# EAGLE board BMC2267ltcvV1.0Proto (EAGLE 5.11)
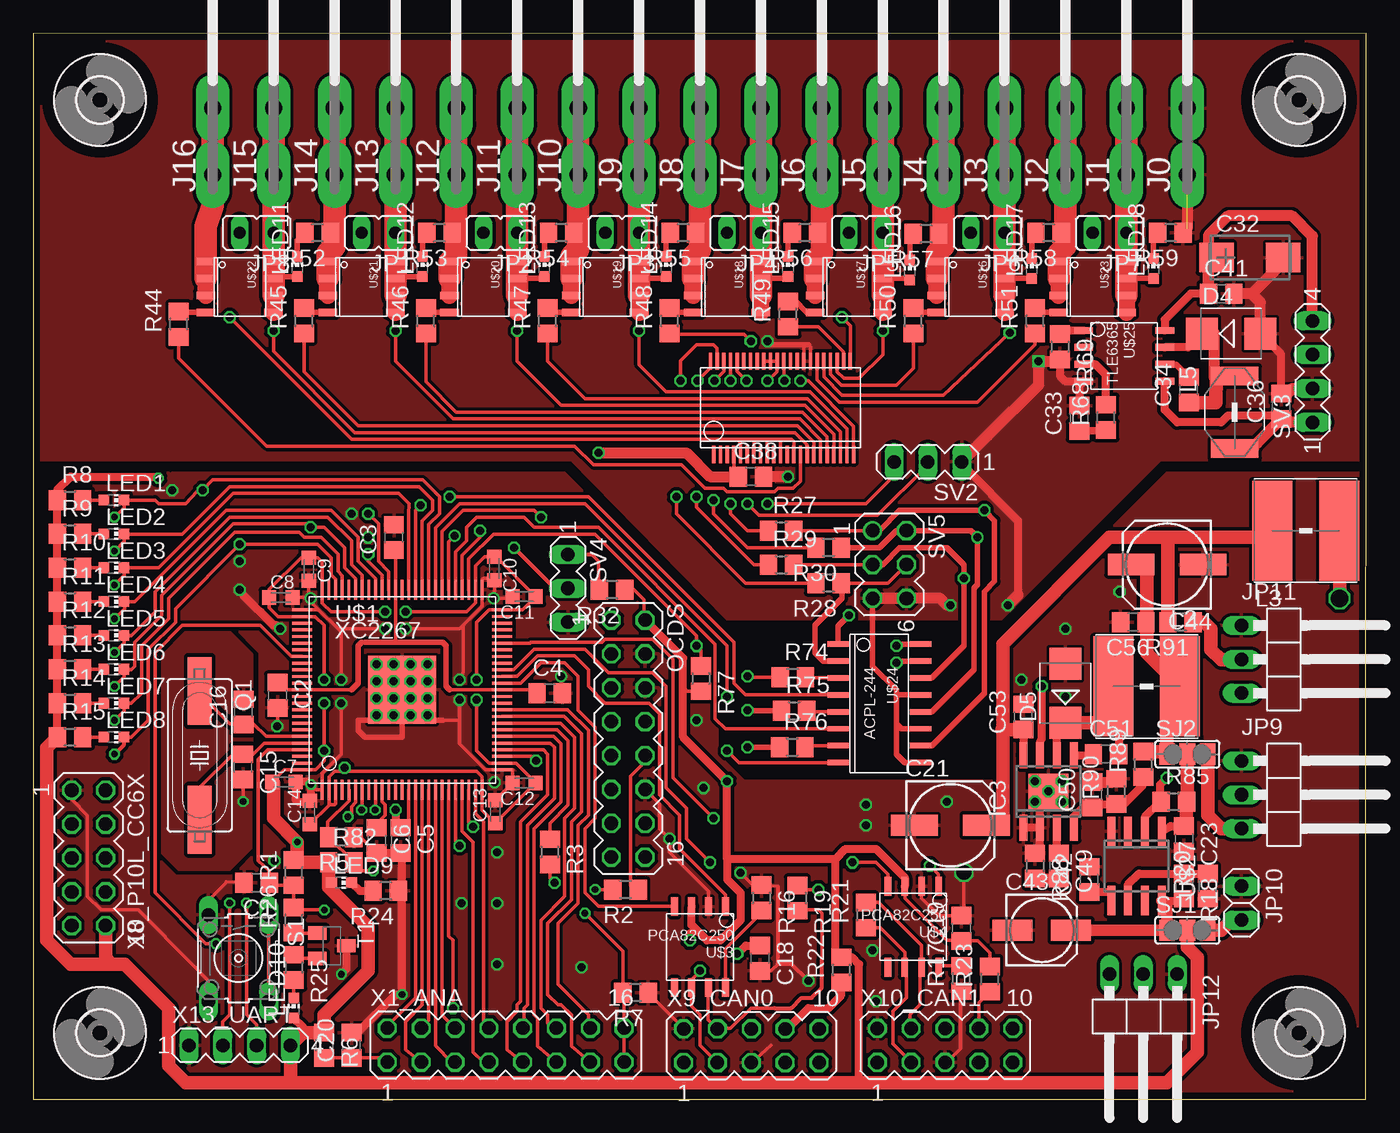
[diagram p2: board, top side]
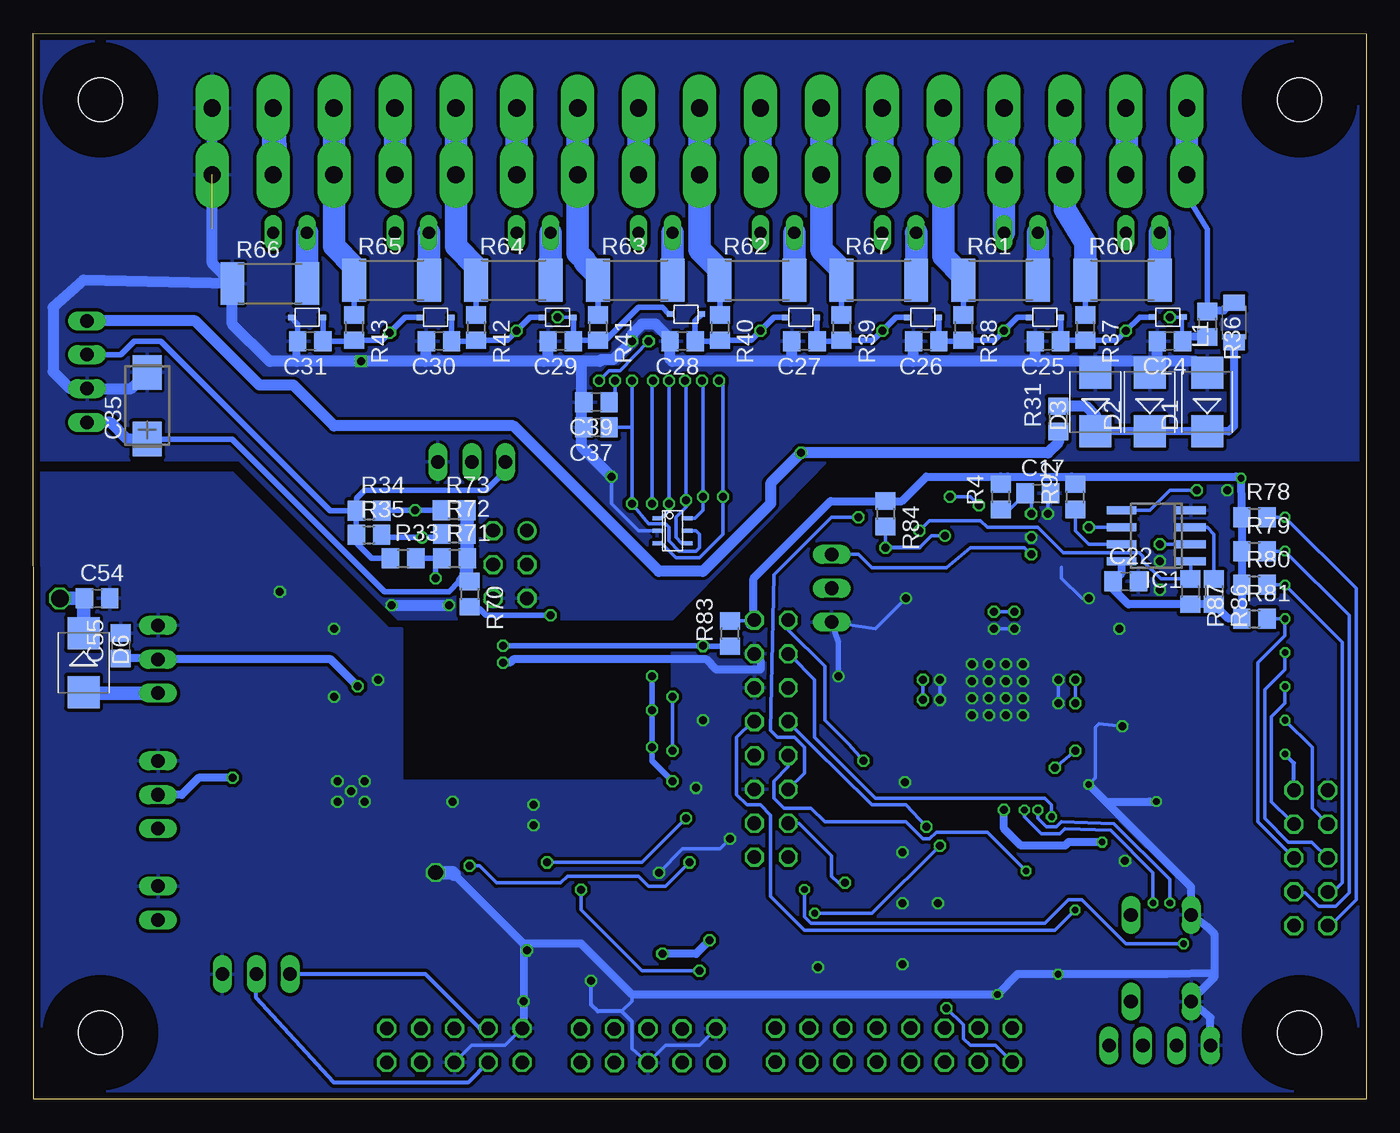
[diagram p3: board, bottom side, seen from below]

Size 100.04 x 79.99 mm. Coordinates in mm from the lower left corner, seen from the top.
Outline: 0,0 99.99,0 100.04,79.99 0,79.96 0,0
Copper layers (1*16): Top 0.035mm / dielectric 1.5mm / Bottom 0.035mm
Design rules "leiton *": minimum track width 6mil, minimum drill 0.3mm, track to track 6mil, track to pad 6mil, pad to pad 6mil, via to via 6mil, smd to smd 6mil, copper to edge 20mil, drill to drill 8mil, minimum pad ring 8mil, minimum via ring 6mil, stop-mask expansion 3mil, vias tented up to drill 0mil, thermal gap 8mil

## Footprints (pad centres in the part's own frame; a part is rotated, then mirrored left to right if it is on the bottom)
C0805 = smd 1.3 x 1.5: 1 -0.95,0; 2 0.95,0
C0603K = smd 1.05 x 1.08: 1 -0.875,0; 2 0.875,0
153CLV-0605 = smd 3.5 x 1.6: + 2.7,0; - -2.7,0
CT6032 = smd 2.6 x 2.2: + -2.5,0; - 2.5,0
153CLV-0505 = smd 3 x 1.6: + 2.2,0; - -2.2,0
SMB = smd 2.4 x 2.4: A 2.2,0; C -2.2,0
3,3 = hole 3.3: 0,0
SO-08 = smd 0.6 x 2.2: 1 -1.905,-2.6; 2 -0.635,-2.6; 3 0.635,-2.6; 4 1.905,-2.6; 5 1.905,2.6; 6 0.635,2.6; 7 -0.635,2.6; 8 -1.905,2.6
SO8-EXP = smd 0.6 x 1.946: 1 -1.905,-2.727; 2 -0.635,-2.727; 3 0.635,-2.727; 4 1.905,-2.727; 5 1.905,2.727; 6 0.635,2.727; 7 -0.635,2.727; 8 -1.905,2.727 | smd 3 x 2.65: 9 0,0
F061.200 = drill 1.3 pad 2.5 long: 1A -2.5,0; 1B 2.5,0
JP1 = drill 0.914 long: 1 0,-1.27; 2 0,1.27
1X03/90 = drill 1.016 long: 1 -2.54,-3.81; 2 0,-3.81; 3 2.54,-3.81
1X02 = drill 1.016 long: 1 -1.27,0; 2 1.27,0
L3216C = smd 1.2 x 1.6: 1 -1.5,0; 2 1.5,0
WE-PD2_L = smd 3 x 7.5: 1 -2.5,0; 2 2.5,0
S = smd 1.4 x 3.56: 1 -2.73,0; 2 2.73,0
CHIP-LED0603 = smd 0.8 x 0.8: A 0,-0.75; C 0,0.75
MA08-2 = drill 1.016 octagon: 1 -8.89,-1.27; 2 -8.89,1.27; 3 -6.35,-1.27; 4 -6.35,1.27; 5 -3.81,-1.27; 6 -3.81,1.27; 7 -1.27,-1.27; 8 -1.27,1.27; 9 1.27,-1.27; 10 1.27,1.27; 11 3.81,-1.27; 12 3.81,1.27; 13 6.35,-1.27; 14 6.35,1.27; 15 8.89,-1.27; 16 8.89,1.27
SM49 = smd 5.08 x 1.778: 1 -4.826,0; 2 4.826,0
R0805 = smd 1.3 x 1.5: 1 -0.95,0; 2 0.95,0
R2512 = smd 1.8 x 3.2: 1 -2.8,0; 2 2.8,0
B3F-10XX = drill 1.016 long: 1 -3.251,2.261; 2 3.251,2.261; 3 -3.251,-2.261; 4 3.251,-2.261
SJ_2 = smd 1.168 x 1.6: 1 -1.524,0; 2 0,0; 3 1.524,0
MA03-1 = drill 1.016 long: 1 -2.54,0; 2 0,0; 3 2.54,0
MA04-1 = drill 1.016 long: 1 -3.81,0; 2 -1.27,0; 3 1.27,0; 4 3.81,0
MA03-2 = drill 1.016 round: 1 -2.54,-1.27 | drill 1.016 octagon: 2 -2.54,1.27; 3 0,-1.27; 4 0,1.27; 5 2.54,-1.27; 6 2.54,1.27
SOT23-BEC = smd 1 x 1.4: B -0.95,-1.1; C 0,1.1; E 0.95,-1.1
LQFP100 = smd 0.22 x 1.5: 1 -6,-7.5; 2 -5.5,-7.5; 3 -5,-7.5; 4 -4.5,-7.5; 5 -4,-7.5; 6 -3.5,-7.5; 7 -3,-7.5; 8 -2.5,-7.5; 9 -2,-7.5; 10 -1.5,-7.5; 11 -1,-7.5; 12 -0.5,-7.5; 13 0,-7.5; 14 0.5,-7.5; 15 1,-7.5; 16 1.5,-7.5; 17 2,-7.5; 18 2.5,-7.5; 19 3,-7.5; 20 3.5,-7.5; 21 4,-7.5; 22 4.5,-7.5; 23 5,-7.5; 24 5.5,-7.5; 25 6,-7.5; 51 6,7.5; 52 5.5,7.5; 53 5,7.5; 54 4.5,7.5; 55 4,7.5; 56 3.5,7.5; 57 3,7.5; 58 2.5,7.5; 59 2,7.5; 60 1.5,7.5; 61 1,7.5; 62 0.5,7.5; 63 0,7.5; 64 -0.5,7.5; 65 -1,7.5; 66 -1.5,7.5; 67 -2,7.5; 68 -2.5,7.5; 69 -3,7.5; 70 -3.5,7.5; 71 -4,7.5; 72 -4.5,7.5; 73 -5,7.5; 74 -5.5,7.5; 75 -6,7.5 | smd 1.5 x 0.22: 26 7.5,-6; 27 7.5,-5.5; 28 7.5,-5; 29 7.5,-4.5; 30 7.5,-4; 31 7.5,-3.5; 32 7.5,-3; 33 7.5,-2.5; 34 7.5,-2; 35 7.5,-1.5; 36 7.5,-1; 37 7.5,-0.5; 38 7.5,0; 39 7.5,0.5; 40 7.5,1; 41 7.5,1.5; 42 7.5,2; 43 7.5,2.5; 44 7.5,3; 45 7.5,3.5; 46 7.5,4; 47 7.5,4.5; 48 7.5,5; 49 7.5,5.5; 50 7.5,6; 76 -7.5,6; 77 -7.5,5.5; 78 -7.5,5; 79 -7.5,4.5; 80 -7.5,4; 81 -7.5,3.5; 82 -7.5,3; 83 -7.5,2.5; 84 -7.5,2; 85 -7.5,1.5; 86 -7.5,1; 87 -7.5,0.5; 88 -7.5,0; 89 -7.5,-0.5; 90 -7.5,-1; 91 -7.5,-1.5; 92 -7.5,-2; 93 -7.5,-2.5; 94 -7.5,-3; 95 -7.5,-3.5; 96 -7.5,-4; 97 -7.5,-4.5; 98 -7.5,-5; 99 -7.5,-5.5; 100 -7.5,-6 | smd 5.08 x 5.08: EXPAD 0,0
PDSO8 = smd 0.508 x 1.4: 1 -1.905,-3.04; 2 -0.635,-3.04; 3 0.635,-3.04; 4 1.905,-3.04; 5 1.905,3.04; 6 0.635,3.04; 7 -0.635,3.04; 8 -1.905,3.04
SSOP44 = smd 0.25 x 1.3: 1 -5.25,-3.5; 2 -4.75,-3.5; 3 -4.25,-3.5; 4 -3.75,-3.5; 5 -3.25,-3.5; 6 -2.75,-3.5; 7 -2.25,-3.5; 8 -1.75,-3.5; 9 -1.25,-3.5; 10 -0.75,-3.5; 11 -0.25,-3.5; 12 0.25,-3.5; 13 0.75,-3.5; 14 1.25,-3.5; 15 1.75,-3.5; 16 2.25,-3.5; 17 2.75,-3.5; 18 3.25,-3.5; 19 3.75,-3.5; 20 4.25,-3.5; 21 4.75,-3.5; 22 5.25,-3.5; 23 5,3.5; 24 4.5,3.5; 25 4,3.5; 26 3.5,3.5; 27 3,3.5; 28 2.5,3.5; 29 2,3.5; 30 1.5,3.5; 31 1,3.5; 32 0.5,3.5; 33 0,3.5; 34 -0.5,3.5; 35 -1,3.5; 36 -1.5,3.5; 37 -2,3.5; 38 -2.5,3.5; 39 -3,3.5; 40 -3.5,3.5; 41 -4,3.5; 42 -4.5,3.5; 43 -5,3.5; 44 -5.5,3.5
SOT457 = smd 0.3 x 0.7: 1 -0.95,-1.15; 2 0,-1.15; 3 0.95,-1.15; 4 0.95,1.15; 5 0,1.15; 6 -0.95,1.15
SOD323 = smd 0.45 x 0.4: A -1.2,0; K 1.2,0
SO8 = smd 0.559 x 1.397: 1 -1.905,-2.54; 2 -0.635,-2.54; 3 0.635,-2.54; 4 1.905,-2.54; 5 1.905,2.54; 6 0.635,2.54; 7 -0.635,2.54; 8 -1.905,2.54
SO16 = smd 0.406 x 1.6: 1 -4.445,-3.09; 2 -3.175,-3.09; 3 -1.905,-3.09; 4 -0.635,-3.09; 5 0.635,-3.09; 6 1.905,-3.09; 7 3.175,-3.09; 8 4.445,-3.09; 9 4.445,3.09; 10 3.175,3.09; 11 1.905,3.09; 12 0.635,3.09; 13 -0.635,3.09; 14 -1.905,3.09; 15 -3.175,3.09; 16 -4.445,3.09
SO8' = smd 0.6 x 2.2: 1 -1.905,-2.6; 2 -0.635,-2.6; 3 0.635,-2.6; 4 1.905,-2.6; 5 1.905,2.6; 6 0.635,2.6; 7 -0.635,2.6; 8 -1.905,2.6
MA05-2 = drill 1.016 octagon: 1 -5.08,-1.27; 2 -5.08,1.27; 3 -2.54,-1.27; 4 -2.54,1.27; 5 0,-1.27; 6 0,1.27; 7 2.54,-1.27; 8 2.54,1.27; 9 5.08,-1.27; 10 5.08,1.27

## Placement (x,y rotation side)
C1  100n  [C0805]  16.76,16.26 180 top
C2  470n  [C0805]  18.34,30.32 270 top
C3  470n  [C0805]  27.06,42.16 90 top
C4  470n  [C0805]  38.76,30.47 0 top
C5  100n  [C0805]  27.56,19.43 270 top
C6  1u  [C0805]  25.78,19.43 270 top
C7  100n  [C0603K]  18.8,23.83 0 top
C8  100n  [C0603K]  18.58,37.67 0 top
C9  100n  [C0603K]  20.68,39.78 270 top
C10  100n  [C0603K]  34.61,39.84 270 top
C11  100n  [C0603K]  36.83,37.73 180 top
C12  100n  [C0603K]  36.83,23.75 180 top
C13  100n  [C0603K]  34.67,21.59 90 top
C14  100n  [C0603K]  20.75,21.53 90 top
C15  18p  [C0805]  15.75,24.94 270 top
C16  18p  [C0805]  15.78,29.08 90 top
C17  10n_opt  [C0805]  24.64,45.47 0 bottom
C18  100n  [C0805]  54.54,10.6 270 top
C19  100n  [C0805]  69.66,12.84 90 top
C20  1u  [C0805]  23.88,4.06 90 top
C21  47u36v  [153CLV-0605]  68.83,20.57 0 top
C22  100n  [C0805]  18.03,38.86 0 bottom
C23  470n  [C0805]  86.36,19.56 270 top
C24  100n  [C0805]  14.73,56.9 180 bottom
C25  100n  [C0805]  23.88,56.9 180 bottom
C26  100n  [C0805]  33.02,56.9 180 bottom
C27  100n  [C0805]  42.16,56.9 180 bottom
C28  100n  [C0805]  51.31,56.9 180 bottom
C29  100n  [C0805]  60.45,56.9 180 bottom
C30  100n  [C0805]  69.6,56.9 180 bottom
C31  100n  [C0805]  79.25,56.9 180 bottom
C32  22u  [CT6032]  91.3,63.16 0 top
C33  470n  [C0805]  78.49,51.11 90 top
C34  10n  [C0805]  86.72,53.24 90 top
C35  100u  [CT6032]  91.49,52.04 90 bottom
C36  220n  [C0805]  93.66,52.01 90 top
C37  1u  [C0805]  57.78,50.42 180 bottom
C38  100n  [C0805]  53.85,46.74 0 top
C39  1u  [C0805]  57.78,52.32 180 bottom
C41  220n  [C0805]  89.15,60.45 0 top
C42  100n  [C0805]  79.25,16.51 90 top
C43  22u10v  [153CLV-0505]  75.69,12.7 0 top
C44  100u10v  [153CLV-0605]  85.09,40.13 180 top
C49  22n  [C0805]  76.96,17.53 270 top
C50  470p  [C0805]  79.5,22.86 90 top
C51  220n  [C0805]  80.52,25.91 0 top
C53  100n  [C0805]  74.3,28.7 90 top
C54  100n  [C0805]  95.25,37.59 0 bottom
C55  100n  [C0805]  93.47,34.04 90 bottom
C56  220n  [C0805]  82.55,35.81 180 top
D1  MBRS130LT3  [SMB]  11.94,52.32 90 bottom
D2  MBRS130LT3  [SMB]  16.26,52.32 90 bottom
D3  MBRS130LT3  [SMB]  20.32,52.32 90 bottom
D4  [SMB]  89.9,57.46 0 top
D5  [SMB]  77.47,30.48 90 top
D6  MBRS130LT3  [SMB]  96.27,32.77 270 bottom
H1  MOUNT-HOLE3.3  [3,3]  5,5 0 top
H2  MOUNT-HOLE3.3  [3,3]  95,5 0 top
H3  MOUNT-HOLE3.3  [3,3]  5,75 0 top
H4  MOUNT-HOLE3.3  [3,3]  95,75 0 top
IC1  25C320  [SO-08]  15.75,42.29 90 bottom
IC3  TLE8366  [SO8-EXP]  76.2,23.11 0 top
J0  PIN2F061.200  [F061.200]  86.61,71.88 90 top
J1  PIN2F061.200  [F061.200]  82.04,71.88 90 top
J2  PIN2F061.200  [F061.200]  77.47,71.88 90 top
J3  PIN2F061.200  [F061.200]  72.9,71.88 90 top
J4  PIN2F061.200  [F061.200]  68.33,71.88 90 top
J5  PIN2F061.200  [F061.200]  63.75,71.88 90 top
J6  PIN2F061.200  [F061.200]  59.18,71.88 90 top
J7  PIN2F061.200  [F061.200]  54.61,71.88 90 top
J8  PIN2F061.200  [F061.200]  50.04,71.88 90 top
J9  PIN2F061.200  [F061.200]  45.47,71.88 90 top
J10  PIN2F061.200  [F061.200]  40.89,71.88 90 top
J11  PIN2F061.200  [F061.200]  36.32,71.88 90 top
J12  PIN2F061.200  [F061.200]  31.75,71.88 90 top
J13  PIN2F061.200  [F061.200]  27.18,71.88 90 top
J14  PIN2F061.200  [F061.200]  22.61,71.88 90 top
J15  PIN2F061.200  [F061.200]  18.03,71.88 90 top
J16  PIN2F061.200  [F061.200]  13.46,71.88 90 top
JP1  [JP1]  25.91,65.02 90 top
JP2  [JP1]  35.05,65.02 90 top
JP3  [JP1]  44.2,65.02 90 top
JP4  [JP1]  53.34,65.02 90 top
JP5  [JP1]  62.48,65.02 90 top
JP6  [JP1]  71.63,65.02 90 top
JP7  [JP1]  80.77,65.02 90 top
JP8  [JP1]  16.76,65.02 90 top
JP9  [1X03/90]  94.49,22.86 270 top
JP10  [1X02]  90.68,14.73 270 top
JP11  [1X03/90]  94.49,33.02 270 top
JP12  [1X03/90]  83.31,5.59 180 top
L1  [L3216C]  9.91,58.29 90 bottom
L2  47µH  [WE-PD2_L]  83.57,30.99 180 top
L3  47µH  [WE-PD2_L]  95.5,42.67 0 top
L5  220µ  [S]  90.17,51.56 270 top
LED1  ge  [CHIP-LED0603]  6.06,44.97 270 top
LED2  ge  [CHIP-LED0603]  6.06,42.43 270 top
LED3  ge  [CHIP-LED0603]  6.06,39.89 270 top
LED4  ge  [CHIP-LED0603]  6.06,37.35 270 top
LED5  ge  [CHIP-LED0603]  6.06,34.81 270 top
LED6  ge  [CHIP-LED0603]  6.06,32.27 270 top
LED7  ge  [CHIP-LED0603]  6.06,29.73 270 top
LED8  ge  [CHIP-LED0603]  6.06,27.19 270 top
LED9  gr  [CHIP-LED0603]  23.15,16.27 270 top
LED10  rt  [CHIP-LED0603]  19.56,6.86 0 top
LED11  ge  [CHIP-LED0603]  19.81,62.48 0 top
LED12  ge  [CHIP-LED0603]  29.21,62.48 0 top
LED13  ge  [CHIP-LED0603]  38.35,62.48 0 top
LED14  ge  [CHIP-LED0603]  47.5,62.48 0 top
LED15  ge  [CHIP-LED0603]  56.64,62.48 0 top
LED16  ge  [CHIP-LED0603]  65.79,62.23 0 top
LED17  ge  [CHIP-LED0603]  74.93,62.36 0 top
LED18  ge  [CHIP-LED0603]  84.07,62.36 0 top
OCDS  [MA08-2]  44.65,27.07 270 top
Q1  8 MHz  [SM49]  12.48,25.81 270 top
R1  10k  [R0805]  19.56,17.02 90 top
R2  0R_opt  [R0805]  44.45,15.75 180 top
R3  0R_opt  [R0805]  38.77,18.57 270 top
R4  10k  [R0805]  27.43,45.21 90 bottom
R5  10k  [R0805]  23.11,19.68 180 top
R6  0R  [R0805]  21.84,4.06 270 top
R7  0R  [R0805]  45.2,8 180 top
R8  1k5  [R0805]  2.76,44.97 0 top
R9  1k5  [R0805]  2.76,42.43 0 top
R10  1k5  [R0805]  2.76,39.89 0 top
R11  1k5  [R0805]  2.76,37.35 0 top
R12  1k5  [R0805]  2.76,34.81 0 top
R13  1k5  [R0805]  2.76,32.27 0 top
R14  1k5  [R0805]  2.76,29.73 0 top
R15  1k5  [R0805]  2.76,27.19 0 top
R16  0R  [R0805]  54.65,15.13 270 top
R17  0R  [R0805]  69.66,9.06 90 top
R18  100k  [R0805]  86.36,16 270 top
R19  120R  [R0805]  57.35,15.11 270 top
R20  56k  [R0805]  88.14,16 90 top
R21  120R  [R0805]  62.48,13.83 90 top
R22  0R_opt  [R0805]  60.66,9.71 90 top
R23  0R_opt  [R0805]  71.79,9.03 90 top
R24  1k5  [R0805]  26.45,15.65 180 top
R25  1k5  [R0805]  19.56,9.91 270 top
R26  47k  [R0805]  19.56,13.46 90 top
R27  100R  [R0805]  56.13,42.67 0 top
R28  100R  [R0805]  59.69,38.73 180 top
R29  100R  [R0805]  56.13,40.13 0 top
R30  20R  [R0805]  59.69,41.4 180 top
R31  100R  [R0805]  23.11,51.05 90 bottom
R32  4k7  [R0805]  43.43,38.23 180 top
R33  1M  [R0805]  72.28,40.6 0 bottom
R34  1M  [R0805]  74.84,44.18 0 bottom
R35  1M  [R0805]  74.85,42.37 0 bottom
R36  100R  [R0805]  11.94,58.17 270 bottom
R37  100R  [R0805]  21.08,57.91 270 bottom
R38  100R  [R0805]  30.23,57.91 270 bottom
R39  100R  [R0805]  39.37,57.91 270 bottom
R40  100R  [R0805]  48.51,57.91 270 bottom
R41  100R  [R0805]  57.66,57.91 270 bottom
R42  100R  [R0805]  66.8,57.91 270 bottom
R43  100R  [R0805]  75.95,57.91 270 bottom
R44  3k3  [R0805]  10.92,58.17 90 top
R45  3k3  [R0805]  20.32,58.42 90 top
R46  3k3  [R0805]  29.46,58.42 90 top
R47  3k3  [R0805]  38.61,58.42 90 top
R48  3k3  [R0805]  47.75,58.42 90 top
R49  3k3  [R0805]  56.64,58.93 90 top
R50  3k3  [R0805]  66.04,58.42 90 top
R51  3k3  [R0805]  75.18,58.42 90 top
R52  470R  [R0805]  21.34,65.02 180 top
R53  470R  [R0805]  30.48,65.02 180 top
R54  470R  [R0805]  39.62,65.02 180 top
R55  470R  [R0805]  48.77,65.02 180 top
R56  470R  [R0805]  57.91,65.02 180 top
R57  470R  [R0805]  67,64.94 180 top
R58  470R  [R0805]  76.2,65.02 180 top
R59  470R  [R0805]  85.34,65.02 180 top
R60  10R  [R2512]  18.29,61.47 0 bottom
R61  10R  [R2512]  27.43,61.47 0 bottom
R62  10R  [R2512]  45.72,61.47 0 bottom
R63  10R  [R2512]  54.86,61.47 0 bottom
R64  10R  [R2512]  64.01,61.47 0 bottom
R65  10R  [R2512]  73.15,61.47 0 bottom
R66  10R  [R2512]  82.3,61.21 0 bottom
R67  10R  [R2512]  36.58,61.47 0 bottom
R68  47k  [R0805]  80.52,51.17 90 top
R69  100k  [R0805]  77.05,56.47 270 top
R70  470R  [R0805]  67.28,37.92 270 bottom
R71  470R  [R0805]  68.42,40.6 0 bottom
R72  470R  [R0805]  68.44,42.42 0 bottom
R73  470R  [R0805]  68.46,44.19 0 bottom
R74  470R  [R0805]  57,31.67 0 top
R75  470R  [R0805]  57.11,29.18 0 top
R76  470R  [R0805]  56.96,26.43 0 top
R77  470R  [R0805]  50.1,31.58 270 top
R78  220R_opt  [R0805]  8.38,43.69 0 bottom
R79  220R_opt  [R0805]  8.38,41.15 0 bottom
R80  220R_opt  [R0805]  8.38,38.61 0 bottom
R81  220R_opt  [R0805]  8.38,36.07 0 bottom
R82  1k_opt  [R0805]  23.11,17.78 0 top
R83  1k_opt  [R0805]  47.74,34.95 90 bottom
R84  4k7  [R0805]  36.07,43.94 270 bottom
R85  OPT_0R  [R0805]  85.6,22.35 0 top
R86  10k  [R0805]  11.43,38.1 270 bottom
R87  10k  [R0805]  13.21,38.1 270 bottom
R88  22k  [R0805]  75.18,17.53 270 top
R89  47k  [R0805]  83.31,25.15 90 top
R90  47k  [R0805]  81.28,23.11 90 top
R91  OPT_0R  [R0805]  86.11,35.81 180 top
R92  10k  [R0805]  21.84,45.21 90 bottom
S1  [B3F-10XX]  15.4,10.6 270 top
SJ1  [SJ_2]  86.61,12.7 0 top
SJ2  [SJ_2]  86.61,25.91 0 top
SV2  [MA03-1]  67.14,47.83 180 top
SV3  [MA04-1]  96.01,54.61 90 top
SV4  [MA03-1]  40.13,38.35 270 top
SV5  [MA03-2]  64.26,40.13 270 top
T1  [SOT23-BEC]  22.41,11.53 270 top
U$1  XC2267  [LQFP100]  27.69,30.73 0 top
U$3  PCA82C250  [PDSO8]  50.04,11.43 180 top
U$4  PCA82C250  [PDSO8]  66.04,12.95 180 top
U$5  LTC6802-1  [SSOP44]  56.32,51.89 0 top
U$6  PRTR5V0U4D  [SOT457]  52.07,42.67 270 bottom
U$8  PDZ7.5B  [SOD323]  14.89,58.7 0 bottom
U$9  PDZ7.5B  [SOD323]  24.13,58.67 0 bottom
U$10  PDZ7.5B  [SOD323]  33.27,58.67 0 bottom
U$11  PDZ7.5B  [SOD323]  42.42,58.67 0 bottom
U$12  PDZ7.5B  [SOD323]  51.05,58.93 0 bottom
U$13  PDZ7.5B  [SOD323]  60.71,58.67 0 bottom
U$14  PDZ7.5B  [SOD323]  69.85,58.67 0 bottom
U$15  PDZ7.5B  [SOD323]  79.5,58.67 0 bottom
U$16  SI4435BDY  [SO8]  70.36,60.96 270 top
U$17  SI4435BDY  [SO8]  61.21,60.96 270 top
U$18  SI4435BDY  [SO8]  52.07,60.96 270 top
U$19  SI4435BDY  [SO8]  42.93,60.96 270 top
U$20  SI4435BDY  [SO8]  33.78,60.96 270 top
U$21  SI4435BDY  [SO8]  24.64,60.96 270 top
U$22  SI4435BDY  [SO8]  15.49,60.96 270 top
U$23  SI4435BDY  [SO8]  79.5,60.96 270 top
U$24  ACPL-244  [SO16]  63.5,29.72 270 top
U$25  TLE6365  [PDSO8]  81.88,55.79 270 top
U$27  TLE4263GS  [SO8']  82.8,17.53 180 top
X1_ANA  [MA08-2]  35.46,4.08 0 top
X8_P10L_CC6X  [MA05-2]  4.15,18.12 270 top
X9_CAN0  [MA05-2]  53.89,4.03 0 top
X10_CAN1  [MA05-2]  68.43,4.06 0 top
X13_UART  [MA04-1]  15.49,4.06 0 top

## Tracks (layer width: path | path; a pad name or v marks a point on that pad's centre or on a via)
5VA
  Top 0.61: U$25.5 84.92,51.73 85.85,50.8 89.15,50.8 89.66,51.31 93.41,51.31 C36.1 | L5.2 91.69,48.83 91.69,49.02 91.62,49.02 | 91.62,49.02 89.92,49.02 | 93.31,50.71 91.62,49.02
  Top 0.813: 91.83,49.23 93.31,50.71 C36.1 93.91,50.8 SV3.1
  Bottom 0.406: R73.2 67.74,44.17 | R72.2 67.72,42.41 | R71.2 67.53,40.41 | R70.1 67.54,38.86 67.82,38.86 68.07,38.86 68.83,38.1 73.66,38.1 85.1,49.54 C35.+
  Bottom 0.813: C35.+ 92.98,49.54 94.23,50.8 SV3.1
  Bottom 1.016: 67.53,40.41 67.53,39.15 67.82,38.86 | R73.2 67.49,44.17 R72.2 67.47,42.41 R71.2
+5V  (via drill 0.5, 0.6)
  Top 0.254: OCDS.2 45.97,36.02 | v33.27,31.5 33.27,35.81 34.19,36.73 U$1.50 36.73,36.73 37.59,37.59 37.59,37.62 C11.1 34.72,40.72 C10.1 33.86,40.72 33.19,40.04 U$1.52 33.19,37.25 32.51,36.58 v27.94,36.58 | v33.27,29.97 33.27,26.16 34.2,25.23 U$1.27 36.22,25.23 C12.1 C13.1 | v26.42,36.58 22.35,36.58 21.69,37.24 U$1.75 21.69,40.29 21.34,40.64 20.7,40.64 C9.1 20.09,40.66 17.7,38.27 C8.1 17.7,36.91 18.38,36.23 U$1.77 21.17,36.23 21.84,35.56 v21.84,31.5 | U$1.2 22.19,23.71 | 23.11,24.64 22.61,24.64 22.19,24.22 U$1.2 | v23.37,24.89 23.11,24.64 | U$1.3 22.69,22.18 22.61,22.1 22.35,22.1 22.19,22.26 | U$1.2 22.19,22.26 | 27.94,20.47 C5.1 28.19,20.88 U$1.14 | 23.11,24.64 33.27,24.64 33.69,24.23 U$1.25 33.69,21.69 34.54,20.83 | v21.84,29.72 v21.84,26.16 21.84,25.4 21.18,24.73 U$1.100 18.83,24.73 C7.1 | R11.1 2.27,37.35 2.03,37.59 2.03,37.34 | C14.1 22.19,22.09 22.19,22.26 | R23.2 71.79,11.02 70.91,11.89 C19.1 69.62,11.94 68.58,11.94 65.41,15.11 U$4.3 | R74.1 53.93,31.67 53.85,31.75 v53.59,31.75 | R77.2 48.88,30.63 48.77,30.73 | 45.82,35.96 45.82,37.49 44.96,38.35 44.51,38.35 R32.1
  Top 0.406: R75.1 53.81,29.18 v53.59,29.21 | R76.1 53.86,26.43 v53.59,26.42
  Top 0.61: 49.66,12.83 50.55,11.94 51.56,11.94 53.09,13.46 53.09,15.49 52.07,16.51 52.07,18.03 | 49.66,12.83 49.38,13.1 49.4,13.12 U$3.3 | v49.28,11.94 49.28,12.45 49.66,12.83 | C18.1 53.46,11.55 v52.83,10.92 | X8_P10L_CC6X.10 5.51,12.95 | v27.18,21.72 27.18,20.64 C5.1 | 18.03,23.72 C7.1 | R1.2 19.81,17.97 | LED10.A 20.25,5.41 20.25,5.01 | R15.1 R14.1 R13.1 R12.1 R11.1 R10.1 R9.1 R8.1 1.81,45.75 2.79,46.74 9.4,46.74 | 52.07,18.03 v52.07,23.88 48.77,27.18 48.77,30.73 48.77,33.12 OCDS.2 45.82,35.96 | LED9.A 22.18,16.27 22.16,16.26 | U$4.3 65.41,16.64 63.25,18.8 60.96,18.8 60.2,18.03 | 61.98,1.27 61.98,10.16 61.47,10.67 R22.2 60.2,10.71 60.2,18.03 | 60.2,18.03 52.07,18.03
  Top 1.016: 18.03,23.72 18.03,21.08 v19.81,19.3 19.81,17.97 | R1.2 19.56,17.78 R82.1 22.16,16.26 22.16,15.94 25.15,12.95 25.15,9.65 21.84,6.35 R6.1 20.25,5.01 X13_UART.4 19.3,1.27 | SJ1.2 86.61,11.43 87.38,10.67 87.38,3.56 85.09,1.27 61.98,1.27 19.3,1.27 | 19.3,1.27 11.43,1.27 10.16,2.54 10.16,6.86 6.86,10.16 5.84,10.16 | 5.84,10.16 2.79,10.16 1.02,11.94 1.02,26.4 R15.1 | X8_P10L_CC6X.10 5.42,10.58 5.84,10.16
  Bottom 0.254: v33.27,31.5 v33.27,29.97 | v26.42,36.58 v27.94,36.58 | v21.84,26.16 v23.37,24.89 | v21.84,29.72 v21.84,31.5 | R83.2 45.98,35.9 OCDS.2 | 27.43,46.74 R4.2 | 27.43,46.74 | R92.2 21.84,46.48 22.1,46.74
  Bottom 0.406: v52.07,23.88 53.59,25.4 v53.59,26.42 v53.59,29.21 v53.59,31.75
  Bottom 0.61: v52.83,10.92 50.29,10.92 v49.28,11.94 | v27.18,21.72 27.18,20.32 25.91,19.05 22.61,19.05 22.35,19.3 v19.81,19.3 | 45.97,35.91 45.97,39.12 40.2,44.89 R84.1 34.86,44.89 33.02,46.74 27.43,46.74 26.92,46.74 | 45.97,35.91 46.28,35.61 | OCDS.2 45.97,35.91 | 26.92,46.74 22.1,46.74 9.78,46.74 v9.4,46.61 9.4,46.16 R78.1 R79.1 R80.1 R81.1 10.35,36.07 R86.2 R87.2 17.85,37.15 18.98,38.29 C22.1 18.35,39.5 IC1.8 | 26.92,46.74 26.86,46.67
/BRKIN  (via drill 0.6)
  Top 0.254: R3.2 38.77,16.6 v39.12,16.26
  Bottom 0.254: v39.12,16.26 39.62,16.26 40.13,16.76 40.13,18.29 42.57,20.72 OCDS.13
/BRKOUT
  Top 0.254: OCDS.10 45.92,25.35 44.83,24.26 44.83,16.06 R2.1
/CS_LTC  (via drill 0.6)
  Top 0.254: U$1.61 28.69,40.62 28.7,40.64 28.7,44.2 v29.08,44.58 | U$24.4 53.47,30.35 52.58,31.24 52.58,34.29 41.66,45.21 v31.24,45.21
  Bottom 0.254: v29.08,44.58 29.72,45.21 v31.24,45.21
/PORST  (via drill 0.5)
  Top 0.254: U$1.97 17.6,26.23 16.89,25.53 16.89,17.91 17.71,17.15 C1.1 | S1.2 S1.1 17.66,16.2 C1.1 | C1.1 17.9,16.07 R1.1 R26.2 19.75,14.22 v21.84,14.22
  Bottom 0.254: OCDS.8 46.08,28.34 47.24,27.18 47.24,22.86 46.48,22.1 45.47,22.1 44.7,21.34 44.7,15.24 42.16,12.7 23.37,12.7 v21.84,14.22
/TRST  (via drill 0.5)
  Top 0.254: U$1.5 23.69,22.42 22.1,20.83 22.1,19.75 R5.2 R82.2 24.7,17.14 v25.53,17.14
  Bottom 0.254: OCDS.9 43.38,24.95 44.45,23.88 44.45,22.61 43.69,21.84 41.66,21.84 40.64,20.83 34.54,20.83 33.27,19.56 32.77,19.56 32.26,20.07 28.45,20.07 v25.53,17.14
ADC0CH0
  Top 0.254: X1_ANA.7 33.95,2.79 33.78,2.79 33.02,3.56 33.02,19.3 32.19,20.14 U$1.22
ADC0CH3
  Top 0.254: U$1.24 33.19,21.42 33.78,20.83 33.78,5.75 X1_ANA.8 34.29,5.2
ADC0CH5
  Top 0.254: X1_ANA.9 35.56,3.72 35.56,5.84 36.32,6.6 36.32,7.11 36.58,7.37 36.58,20.83 38.61,22.86 38.61,25.91 38.28,26.23 U$1.29
ADC0CH8
  Top 0.254: X1_ANA.10 36.83,5.2 36.83,6.86 37.08,7.11 37.08,20.57 39.12,22.61 39.12,26.42 38.8,26.73 U$1.30
ADC0CH9
  Top 0.254: X1_ANA.11 37.85,3.98 37.85,6.1 37.59,6.35 37.59,20.32 39.62,22.35 39.62,26.67 39.06,27.23 U$1.31
ADC0CH11
  Top 0.254: 39.12,5.25 X1_ANA.12 38.61,5.75 38.61,6.35 38.1,6.86 38.1,13.46 39.88,15.24 39.88,21.08 40.64,21.84 40.64,27.18 39.58,28.23 U$1.33
ADC0CH13
  Top 0.254: X1_ANA.13 40.39,3.98 40.39,6.35 39.62,7.11 39.37,7.11 38.61,7.87 38.61,13.21 40.39,14.99 40.39,20.83 41.15,21.59 41.15,27.43 39.85,28.73 U$1.34
ADC0CH15
  Top 0.254: X1_ANA.14 41.66,5.25 41.66,6.35 39.37,8.64 39.37,13.21 40.89,14.73 40.89,20.57 41.66,21.34 41.66,27.69 40.11,29.23 U$1.35
ADC1CH0
  Top 0.254: X1_ANA.2 26.67,5.2 26.67,5.59 28.7,7.62 28.7,21.59 28.69,22.11 U$1.15
ADC1CH2
  Top 0.254: X1_ANA.3 27.94,3.72 27.94,5.84 29.19,7.09 U$1.16
ADC1CH4
  Top 0.254: U$1.17 29.69,5.93 X1_ANA.4
ADC1CH5
  Top 0.254: U$1.18 30.19,4.03 31.41,2.81 X1_ANA.5
ADC1CH6
  Top 0.254: 31.75,5.2 X1_ANA.6 30.69,6.31 U$1.19
C1  (via drill 0.6)
  Top 0.254: U$5.27 59.32,54.21 60.71,52.83 68.33,52.83 v73.28,57.53
  Bottom 0.406: U$14.A 72.14,58.67 v73.28,57.53 73.85,56.96 R43.2 76.01,56.9 C31.1 U$15.K
C2  (via drill 0.6)
  Top 0.254: U$5.25 60.32,54.61 60.83,54.1 61.98,54.1 63.75,55.88 v63.75,57.66
  Bottom 0.406: U$14.K C30.1 66.87,56.9 R42.2 64.45,56.96 v63.75,57.66 62.74,58.67 U$13.A
C3  (via drill 0.6)
  Top 0.254: U$5.23 61.32,58.06 v60.71,58.67
  Bottom 0.254: U$13.K v60.71,58.67
  Bottom 0.406: U$13.K C29.1 59.44,56.96 R41.2 57.59,56.9 57.15,56.9 54.61,59.44 52.83,59.44 52.32,58.93 U$12.A
C4  (via drill 0.6)
  Top 0.254: U$5.21 61.07,50.3 58.29,53.09 47.5,53.09 45.47,55.12 v45.47,57.66
  Bottom 0.406: U$11.A 44.45,58.67 v45.47,57.66 46.16,56.96 R40.2 | R40.2 arc90 48.76,56.71 49.09,56.71 | R40.2 arc90 48.45,56.9 C28.1 50.36,58.42 U$12.K
C5  (via drill 0.6)
  Top 0.254: U$5.19 60.07,49.91 57.91,52.07 39.62,52.07 36.32,55.37 v36.32,57.66
  Bottom 0.406: U$10.A 35.31,58.67 v36.32,57.66 37.02,56.96 38.86,56.96 | 38.86,56.96 R39.2 | U$11.K C27.1 38.93,56.9 38.86,56.96
C6  (via drill 0.6)
  Top 0.254: U$5.17 59.07,49.51 57.53,51.05 31.5,51.05 27.18,55.37 v27.18,57.66
  Bottom 0.406: U$9.A 26.16,58.67 v27.18,57.66 27.87,56.96 29.72,56.96 | 29.72,56.96 R38.2 | U$10.K C26.1 29.78,56.9 29.72,56.96
C7  (via drill 0.6)
  Top 0.254: U$5.15 58.07,49.11 57.15,50.04 24.13,50.04 18.03,56.13 v18.03,57.66
  Bottom 0.406: U$8.A 16.99,58.7 v18.03,57.66 18.73,56.96 R37.2 22.86,56.96 C25.1 U$9.K
C8  (via drill 0.6)
  Top 0.254: U$5.5 53.07,49.29 52.83,49.53 | 52.83,49.53 23.88,49.53 v14.73,58.67 | U$5.13 57.07,49.35 56.9,49.53 56.13,49.53 | 52.83,49.53 54.1,49.53 | 54.1,49.53 55.12,49.53 | 55.12,49.53 56.13,49.53 | U$5.7 54.07,49.5 54.1,49.53 | U$5.9 55.07,49.49 55.12,49.53 | U$5.11 56.07,49.47 56.13,49.53
  Bottom 0.254: v14.73,58.67 13.72,58.67 U$8.K
  Bottom 0.305: C24.1 13.78,58.61 U$8.K
  Bottom 0.61: R36.2 13.46,57.22 C24.1
CELL1
  Top 0.406: R58.1 77.15,64.84 77.47,64.52
  Top 1.27: U$23.2 U$23.3
  Top 1.676: U$23.2 U$23.1 76.96,63.5 77.47,64.01 77.47,64.52 J2.1B
  Bottom 0.406: R43.1 R65.1
  Bottom 1.676: R65.1 75.95,62.49 77.47,64.01 J2.1B J2.1A
CELL2
  Top 0.406: R57.1 67.95,64.64 68.33,64.26
  Top 1.27: U$16.3 U$16.2
  Top 1.676: U$16.1 U$16.2 67.82,63.5 68.33,64.01 68.33,64.26 J4.1B
  Bottom 0.406: R64.1 R42.1
  Bottom 1.676: R64.1 66.8,62.48 68.33,64.01 J4.1B J4.1A
CELL3
  Top 0.406: R56.1 58.86,64.07 59.18,63.75
  Top 1.27: U$17.2 U$17.3
  Top 1.676: U$17.2 U$17.1 58.67,62.99 59.18,63.5 59.18,63.75 J6.1B
  Bottom 0.406: R41.1 R63.1
  Bottom 1.676: R63.1 57.66,61.85 U$17.1 58.67,62.99 59.18,63.5 J6.1B J6.1A
CELL4
  Top 0.406: R55.1 49.72,64.33 50.04,64.01
  Top 1.27: U$18.3 U$18.2
  Top 1.676: U$18.2 U$18.1 49.53,63.25 50.04,63.75 50.04,64.01 J8.1B
  Bottom 0.406: R40.1 R62.1
  Bottom 1.676: R62.1 48.52,62.24 50.04,63.75 J8.1B J8.1A
CELL5
  Top 0.406: R54.1 40.57,64.58 40.89,64.26
  Top 1.27: U$19.3 U$19.2
  Top 1.676: U$19.2 U$19.1 40.39,63.25 40.89,63.75 40.89,64.26 J10.1B
  Bottom 0.406: R39.1 R67.1
  Bottom 1.676: R67.1 39.38,62.24 40.89,63.75 J10.1B J10.1A
CELL6
  Top 0.406: R53.1 31.43,64.07 31.75,63.75
  Top 1.27: U$20.2 U$20.3
  Top 1.676: U$20.2 U$20.1 31.37,62.87 31.75,63.25 31.75,63.75 J12.1B
  Bottom 0.406: R38.1 R61.1
  Bottom 1.676: R61.1 30.23,61.73 31.75,63.25 J12.1B J12.1A
CELL7
  Top 0.406: R52.1 22.29,65.21 22.61,65.53
  Top 1.27: U$21.3 U$21.2
  Top 1.676: J14.1B 22.61,65.53 22.61,64.01 22.1,63.5 U$21.1 U$21.2
  Bottom 0.406: R60.1 R37.1
  Bottom 1.676: R60.1 21.09,64.27 22.61,66.8 J14.1B J14.1A
CELL8
  Top 1.27: U$22.2 U$22.3
  Top 1.676: J16.1B 13.46,67.06 12.95,65.53 U$22.1 U$22.2
  Bottom 0.406: R36.1 11.94,65.28 13.46,67.82 J16.1B
  Bottom 0.61: L1.2 10.06,59.79 10.67,59.18 12.06,59.18 11.89,59.17 R36.1
  Bottom 1.676: J16.1B J16.1A
CSB  (via drill 0.6)
  Top 0.254: U$5.44 50.82,54.89 v49.85,53.91 | v49.78,45.21 49.78,44.45 54.1,40.13 R29.1
  Bottom 0.254: v49.85,53.91 49.78,53.85 v49.78,45.21 49.78,44.2 50.36,43.62 U$6.6
CSBG  (via drill 0.6)
  Top 0.254: R29.2 SV5.3
  Top 0.406: U$24.14 67.44,31.62 69.85,34.04 v69.85,39.12 69.85,40.13 68.58,41.4 65.02,41.4 63.75,40.13 SV5.3
  Bottom 0.406: v69.85,39.12 69.85,40.12 R71.1 70.82,40.6 R33.2
GND  (via drill 0.5, 0.6, 1.1)
  Top 0.254: 45.77,30.99 OCDS.6 45.92,31.3 | 54.07,2.76 X9_CAN0.5 55.37,4.06 | C18.2 55.37,9.65 55.88,10.16 55.88,16 R16.1 54.02,16.08 v53.09,17.02 | OCDS.12 46.99,22.19 46.99,20.32 v47.75,19.56 47.75,18.54 50.67,15.62 U$3.2 | 32.26,35.56 33.69,36.99 U$1.51 33.69,39.02 33.78,39.12 34.46,39.12 C10.2 34.61,37.66 v34.54,37.59 35.82,37.59 C11.2 | 32.26,35.56 32.26,32 v32,31.5 | v32,29.97 32,28.45 | 21.43,36.73 U$1.76 | 22.86,35.31 21.43,36.73 | 22.86,35.31 v26.42,35.31 | v27.94,35.31 32,35.31 32.26,35.56 | v23.11,29.72 23.11,25.91 21.69,24.48 U$1.1 21.22,23.23 v20.83,23.62 | v23.11,31.5 23.11,35.05 22.86,35.31 | U$1.EXPAD 28.45,30.73 | 32,28.45 30.73,28.45 | v15.75,22.35 C15.2 | C16.2 16.23,30.09 | C8.2 20.75,37.67 v20.83,37.59 | C9.2 20.68,37.74 v20.83,37.59 | 21.43,36.73 20.83,37.34 v20.83,37.59 | 32,28.45 32,26.67 33.94,24.73 U$1.26 35.95,24.73 C12.2 C13.2 | v39.62,31.75 39.62,30.56 C4.2 | X9_CAN0.2 48.81,5.35 R7.1 | C6.2 24.58,19.68 R5.1 | X8_P10L_CC6X.1 2.88,22.52 4.06,21.34 4.06,15.24 5.08,14.22 7.87,14.22 11.94,10.16 13.14,8.89 S1.4 | C1.2 14.48,16.32 14.48,16.26 13.14,14.92 S1.3 | 66.67,15.37 U$4.2 66.67,15.11 67.99,13.79 C19.2 | C19.2 69.58,13.72 | R17.1 69.6,8.05 69.6,3.81 68.57,2.79 X10_CAN1.5 | C19.2 69.85,13.98 v69.85,17.02 | C2.2 18.34,28.24 v18.29,28 | C3.2 27.18,43.23
  Top 0.305: 55.88,10.16 56.9,10.16 v58.17,8.89
  Top 0.406: U$24.15 65.15,32.89 v64.77,32.77 | 30.73,28.45 24.38,28.45 24.38,27.69 24.89,27.18 27.69,27.18 U$1.EXPAD
  Top 0.61: C14.2 20.7,22.35 19.81,22.35 19.67,22.49 C7.2 20.62,23.83 v20.83,23.62 20.83,22.35 | 23.62,11.64 T1.C 23.51,9.79 v23.11,9.4 | C20.2 24.32,5.01 27.18,7.87 v27.69,7.87 27.69,18.03 27.62,18.35 27.43,18.35 C5.2 C6.2 | 15.75,37.85 18.03,35.56 18.29,35.56 v18.54,35.31 | IC3.2 75.56,18.6 R88.1 | IC3.2 IC3.1 | IC3.2 75.56,23.24 IC3.9
  Top 0.813: C50.2 81.03,23.81 R90.2
  Bottom 0.254: 45.92,33.33 OCDS.4 45.97,33.48 | 55.12,5.84 55.12,3.81 X9_CAN0.5 52.59,4.06 50.04,4.06 50.04,4.07 X9_CAN0.2 48.78,5.33 | v32,31.5 v32,29.97 | v26.42,35.31 v27.94,35.31 | v23.11,29.72 v23.11,31.5 | 55.12,7.87 55.12,7.37 55.88,6.6 | SV4.3 36.83,35.31 v34.54,37.59 | v20.83,37.59 21.34,37.59 22.86,39.12 22.86,39.93 | X10_CAN1.2 64.61,4.06 67.15,4.06 X10_CAN1.5 | v53.09,17.02 51.31,18.8 48.51,18.8 v47.75,19.56 | v18.29,28 20.07,28.19 20.32,27.94 20.32,24.13 v20.83,23.62 | v25.15,42.16 25.4,42.42 | 23.88,44.45 23.88,45.28 C17.2
  Bottom 0.305: 55.12,5.84 55.88,6.6 57.66,6.6 58.17,7.11 v58.17,8.89
  Bottom 0.406: v39.62,31.75 39.62,34.29 SV4.3
  Bottom 0.61: 63.25,11.68 68.45,16.89 | 19.56,22.35 16.26,22.35 v15.75,22.35 | 19.56,22.35 v20.83,23.62 | 19.56,22.35 13.14,15.94 S1.3 11.94,12.95 11.36,12.38 11.36,9.46 | X13_UART.1 11.68,6.14 S1.4 13.21,7.37 11.36,9.21 11.36,9.46 | 11.36,9.46 14.99,9.4 v23.11,9.4 26.16,9.4 v27.69,7.87 55.12,7.87 58.93,11.68 63.25,11.68 | X10_CAN1.2 63.25,5.43 63.25,11.68 | v64.77,32.77 64.26,32.77 64.01,33.02 49.53,33.02 48.77,32.26 45.47,32.26 45.47,32.97 OCDS.4
  Bottom 1.016: v69.85,17.02 68.58,17.02 68.45,16.89
  other vias: 34.8,10.16 34.8,14.73 34.8,18.54 32.13,14.73 49.78,28.45 50.29,23.37 62.48,20.57 25.78,32.64 27.05,32.64 28.32,32.64 29.59,32.64 25.78,31.37 27.05,31.37 28.32,31.37 29.59,31.37 25.78,30.1 25.78,28.83 27.05,28.83 28.32,28.83 29.59,28.83 29.59,30.1 28.32,30.1 27.05,30.1 41.15,9.91 18.1,17.91 34.61,23.81 75.18,23.88 77.22,23.88 76.2,23.11 75.18,22.35 77.22,22.35 81.53,38.1 74.17,31.5 77.47,35.31 77.47,30.23 63.25,7.37 62.99,11.18 62.48,22.1 68.58,22.35 15.49,40.39 23.88,43.94 15.49,38.23 10.41,45.72
  pour Top (isolate 0.305): 9.65,18.54 9.65,33.27 11.43,35.05 14.73,35.05 16.38,33.4 16.38,18.92 14.73,17.27 10.92,17.27
  pour Bottom (isolate 0.254): 39.88,46.99 52.07,34.8 52.07,25.15 53.34,23.88 72.39,23.88 72.39,35.31 73.41,35.31 85.09,46.99 100.08,46.99 99.82,0.51 100.08,0.25 0.25,0.25 0.25,46.99
  pour Top (isolate 0.254): 100.08,46.99 85.09,46.99 73.41,35.31 72.39,35.31 72.39,23.88 53.34,23.88 51.31,25.91 51.31,35.56 39.88,46.99 10.41,46.99 10.41,34.8 11.18,35.56 14.99,35.56 17.02,33.53 17.02,18.8 14.99,16.76 10.67,16.76 9.14,18.29 9.14,33.53 10.16,34.54 10.16,46.99 0.25,46.99 0,0 100.08,0
GNDA  (via drill 0.6)  (1 unrouted)
  Top 0.254: U$5.29 58.32,56.48 58.17,56.64 | U$5.30 57.82,56.48 57.66,56.64
  Top 0.406: v55.12,56.9 55.37,56.64 57.66,56.64 58.17,56.64 | U$24.9 65.41,25.27 64.77,25.91 64.77,28.19 | 64.77,30.48 64.77,28.19 | U$24.11 65.15,27.81 64.77,28.19 | U$24.13 64.9,30.35 64.77,30.48 | 64.77,30.48 64.77,30.73 62.99,32.51 SV5.5
  Top 0.61: R69.2 77.05,54.26 77.43,53.89 U$25.4 78.49,53.54 C33.2 | C36.2 93.66,55.9 D4.A | 73.91,37.85 73.91,43.43 69.85,47.5
  Top 0.813: v56.64,46.74 C38.2 | SV5.6 SV5.5 68.07,37.59 68.58,37.08 v68.83,37.08 | 71.63,49.78 SV2.1 69.85,47.66 69.85,47.5 | 73.91,37.85 v73.15,37.08 | C36.2 94.11,52.96 94.49,53.34 SV3.2 | D4.A 92.1,59.8 91.44,60.45 | 91.44,60.45 C41.2 | C32.- 93.8,62.82 91.44,60.45 | 71.63,49.78 | 77.22,55.36 R69.2 76.9,55.37 v75.44,55.37 75.44,53.59 71.63,49.78 | R59.1 86.61,65.34 J0.1B
  Bottom 0.254: U$6.2 54.61,42.67 56.64,44.7 v56.64,46.74 | C37.2 58.86,50.87 58.93,50.8 | 58.93,52.32 C39.2
  Bottom 0.406: C31.2 80.2,58.17 U$15.A
  Bottom 0.61: C31.2 80.26,56.83 80.26,55.37
  Bottom 0.813: 15.41,55.37 20.32,55.37 | 20.32,55.37 24.64,55.37 | 24.64,55.37 34.04,55.37 | 34.04,55.37 43.18,55.37 | 61.72,55.37 70.61,55.37 | D1.A 12.79,55.37 15.41,55.37 | 15.68,55.1 C24.2 | 15.68,55.1 D2.A | 20.32,55.37 D3.A | C25.2 24.83,55.56 24.64,55.37 | 15.41,55.37 15.68,55.1 | C26.2 33.97,55.44 34.04,55.37 | C27.2 43.11,55.44 43.18,55.37 | C30.2 70.55,55.44 70.61,55.37 | C29.2 61.4,55.69 61.72,55.37 | 43.18,55.37 52.07,55.37 52.26,55.56 C28.2 52.26,57.08 53.34,58.17 54.36,58.17 55.12,57.4 v55.12,56.9 56.52,55.5 57.4,55.5 57.53,55.37 58.93,55.37 | 58.93,55.37 61.72,55.37 | v56.64,46.74 58.93,49.02 58.93,50.8 58.93,52.32 58.93,55.37 | R66.1 96.27,61.47 98.55,59.44 98.55,54.61 97.28,53.34 SV3.2 92.7,53.34 C35.- | v73.15,37.08 v68.83,37.08 | 70.61,55.37 v75.44,55.37 80.26,55.37 82.3,55.37 85.1,58.17 R66.1 | R66.1 86.61,62.73 J0.1B
  pour Top (isolate 0.254): 0.25,80.01 100.08,80.01 100.08,48.01 84.58,48.01 72.64,36.07 52.07,36.07 40.39,48.01 0,48.01 0,79.76
  pour Bottom (isolate 0.254): 0,80.01 99.82,80.01 100.08,79.76 100.08,48.01 84.58,48.01 72.64,36.07 52.07,36.07 40.39,48.01 0,48.01
LIN5V
  Top 0.61: SJ1.1 84.96,12.83 | R18.2 86.49,14.93 U$27.8
  Top 0.864: U$27.8 85.09,14.8 SJ1.1 C43.+
N$1
  Top 0.254: R3.1 38.77,20.73 40.13,22.1 40.13,26.92 39.32,27.73 U$1.32
N$2
  Top 0.254: R15.2 LED8.A
N$3
  Top 0.254: R14.2 LED7.A
N$4
  Top 0.254: 27.18,34.29 27.19,34.3 U$1.64 27.19,41.19 C3.1 | 31.24,30.73 U$1.38 37.55,30.73 C4.1 | 23.88,30.73 U$1.88 18.88,30.73 C2.1 | 24.64,34.29 24.89,34.29
  Top 0.406: 31.24,30.73 30.99,30.99 30.99,34.04 30.73,34.29 27.18,34.29 24.89,34.29 | 24.64,34.29 24.38,34.04 24.38,31.24 23.88,30.73
N$5
  Top 0.254: R13.2 LED6.A
N$6
  Top 0.254: R12.2 LED5.A
N$7
  Top 0.254: R11.2 LED4.A
N$8
  Top 0.254: R10.2 LED3.A
N$9
  Top 0.61: R24.2 24.52,15.65 LED9.C
N$10
  Top 0.254: R9.2 LED2.A
N$11
  Top 0.254: R8.2 LED1.A
N$12
  Top 0.254: U$4.8 68.05,10.01 R17.2
N$13
  Top 0.254: R16.2 54.65,14.01 51.92,11.29 51.94,11.27 U$3.8
N$14
  Top 0.254: X10_CAN1.4 65.79,5.43 65.79,6.35 66.55,7.11 66.55,9.79 U$4.7 66.67,11.56 63.45,14.78 R21.2
  Bottom 0.305: JP12.3 70.61,9.4 66.55,5.33 X10_CAN1.4
N$15
  Top 0.254: X10_CAN1.8 70.97,7.27 R23.1
N$16
  Top 0.254: R25.1 19.83,10.58 T1.E
N$17
  Top 0.254: LED10.C R25.2
N$18
  Top 0.254: X10_CAN1.3 64.52,4.16 64.52,6.6 65.53,7.62 65.53,9.79 U$4.6 65.41,11.05 63.57,12.88 R21.1
  Bottom 0.305: JP12.2 83.31,7.62 77.47,1.27 67.41,1.27 X10_CAN1.3
N$19
  Top 0.61: R22.1 60.66,7.82 59.69,6.86 58.17,6.86 56.82,5.51 56.64,5.51 X9_CAN0.8
N$20
  Top 0.254: U$3.7 50.66,8.37 50.66,6 X9_CAN0.4 51.38,5.33 52.32,5.33 53.85,6.86 55.63,6.86 | 59.18,10.41 59.18,13.97 58.93,14.22 57.42,14.22 R19.2
  Top 0.305: 55.63,6.86 56.9,6.86 57.66,7.62 58.42,7.62 59.18,8.38 59.18,10.41
  Top 0.61: X9_CAN0.4 51.42,5.37
N$21
  Top 0.254: 25.65,20.47 C6.1 26.04,20.51 26.04,20.95 26.42,21.34 26.42,22.1 26.19,22.33 U$1.10
N$23
  Top 0.61: C42.1 80.71,15.56 80.9,15.49 U$27.5
N$24  (via drill 0.6)
  Top 0.254: X9_CAN0.3 50.04,4.07 50.04,6.35 49.38,7 49.38,8.37 U$3.6 49.38,8.41 49.38,9 v50.04,9.65 | v58.93,15.75 57.66,15.75 R19.1
  Bottom 0.254: v50.04,9.65 54.36,9.65 58.93,14.22 v58.93,15.75
N$25
  Top 0.254: R26.1 19.59,12.48 T1.B
N$27
  Bottom 0.254: R86.1 11.43,42.42 11.94,42.93 IC1.3
N$28
  Top 0.254: U$24.3 57.99,31.62 R74.2
N$29
  Top 0.254: U$24.5 58.15,29.08 R75.2
N$30
  Top 0.254: U$24.7 58.02,26.54 R76.2
N$31
  Top 0.61: C23.1 85.34,20.51 U$27.1
  Top 1.016: SJ2.2 86.61,22.54 R85.2 86.55,20.7 C23.1
N$32
  Top 0.61: U$27.6 82.17,16.13 82.99,16.95 R18.1 R20.2
N$33  (via drill 0.6)
  Top 0.61: U$27.2 83.44,21.21 84.58,22.35 | 84.58,22.35 R85.1 84.58,22.35 | 84.58,22.35 84.58,23.62 v85.09,24.13
  Bottom 0.61: v85.09,24.13 87.63,24.13 88.9,22.86 JP9.2
N$34  (via drill 0.6)
  Top 0.406: U$24.1 60.41,35.52 v61.21,36.32
  Bottom 0.406: R70.2 67.39,36.83 66.55,36.83 66.04,36.32 v61.21,36.32
N$35
  Top 0.254: Q1.2 12.48,23.41 14.99,25.91 15.73,25.91 C15.1 16.5,25.89 17.34,26.73 U$1.96
N$36
  Top 0.254: U$1.95 17.47,27.23 16.51,28.19 16.35,28.19 C16.1 16.22,28.19 14.73,28.19 12.48,30.44 Q1.1
N$37
  Top 1.016: SJ2.3 88.14,21.34 89.15,20.32 JP9.3
N$38
  Top 1.016: JP10.2 89.92,13.46 89.15,12.7 SJ1.3
N$40
  Top 0.406: U$23.4 75.5,59.05 R51.2
N$41
  Top 0.406: LED11.A 18.17,61.73 U$22.7
  Top 1.27: U$22.5 U$22.6
  Top 1.676: U$22.6 U$22.7 U$22.8 JP8.1 J15.1B
  Bottom 1.676: 18.03,71.37 J15.1A 18.03,69.34 17.92,70.87 J15.1B
N$42
  Top 0.406: U$21.4 20.64,59.05 R45.2
N$43
  Top 0.406: LED12.A 27.32,61.73 U$21.7
  Top 1.27: U$21.5 U$21.6
  Top 1.676: J13.1B U$21.8 U$21.7 U$21.6
  Bottom 1.676: JP1.1 J13.1B J13.1A
N$44
  Top 0.406: U$19.4 38.92,59.05 R47.2
N$45
  Top 0.406: U$20.7 38.22,61.59 LED13.A
  Top 1.27: U$20.5 U$20.6
  Top 1.676: U$20.6 U$20.7 U$20.8 JP2.1 J11.1B
  Bottom 1.676: J11.1B J11.1A
N$46
  Top 0.406: U$20.4 29.78,59.05 R46.2
N$47
  Top 0.406: U$19.7 47.36,61.59 LED14.A
  Top 1.27: U$19.6 U$19.5
  Top 1.676: U$19.6 U$19.7 U$19.8 JP3.1 J9.1B
  Bottom 1.676: J9.1B J9.1A
N$48
  Top 0.406: U$22.4 10.98,59.05 R44.2
N$49
  Top 0.406: U$18.7 56.53,61.59 LED15.A
  Top 1.27: U$18.5 U$18.6
  Top 1.676: U$18.6 U$18.7 U$18.8 JP4.1 J7.1B
  Bottom 1.676: J7.1B J7.1A
N$50
  Bottom 0.254: IC1.7 20.83,41.66 21.84,42.67 R92.1
N$51
  Top 0.406: U$18.4 48.07,59.05 R48.2
N$52
  Top 0.406: U$17.4 58.04,59.05 57.15,59.94 56.71,59.94 R49.2
N$53
  Top 0.406: U$16.4 66.36,59.05 R50.2
N$55
  Top 0.813: R88.2 C49.2
N$56
  Top 0.61: IC3.3 76.83,18.6 C49.1
N$57
  Top 0.61: IC3.4 78.11,21.21 78.81,21.91 C50.1 79.76,22.16 R90.1 81.85,22.16 83.31,23.62 R89.1
N$58
  Top 0.61: C33.1 78.43,50.16 R68.1
N$59
  Top 0.61: U$25.3 79.72,55.16 80.52,54.36 R68.2
N$60
  Top 0.61: IC3.5 79.57,25.84 C51.1
N$61
  Top 0.61: U$25.1 77.33,57.7 R69.1
N$62
  Top 0.406: U$17.7 65.67,61.59 LED16.A
  Top 1.27: U$17.5 U$17.6
  Top 1.676: U$17.6 U$17.7 U$17.8 JP5.1 J5.1B
  Bottom 1.676: J5.1B J5.1A
N$63
  Top 0.406: LED17.A 72.91,61.61 U$16.7
  Top 1.27: U$16.5 U$16.6
  Top 1.676: U$16.6 U$16.7 U$16.8 JP6.1 J3.1B
  Bottom 1.676: J3.1A J3.1B 72.9,69.85
N$64
  Top 0.406: U$23.7 84.06,61.59 LED18.A
  Top 1.27: U$23.6 U$23.5
  Top 1.676: J1.1B JP7.1 U$23.8 U$23.7 U$23.6
  Bottom 1.676: J1.1B J1.1A | J1.1B 82.04,70.61 81.79,70.1 81.79,70.25 J1.1B
N$65
  Top 0.406: LED18.C 84.07,64.7 R59.2
N$66
  Top 0.406: LED17.C 74.93,64.7 R58.2
N$67
  Top 0.406: LED16.C 65.79,64.68 R57.2
N$68
  Top 0.406: LED15.C 56.64,64.7 R56.2
N$69
  Top 0.406: LED14.C 47.5,64.7 R55.2
N$70
  Top 0.406: LED13.C 38.35,64.7 R54.2
N$71
  Top 0.406: LED12.C 29.21,64.7 R53.2
N$72
  Top 0.406: LED11.C 19.81,64.45 R52.2
N$73
  Bottom 1.676: R67.2 JP2.2
N$74
  Bottom 1.676: R62.2 JP3.2
N$75
  Top 0.61: 77.6,28.53 D5.C 76.83,28.41 IC3.6 | 81.28,29.04 81.28,28.7 | 81.28,28.7 81.07,28.7 81.07,30.48 | 81.07,30.48 L2.2 | 81.07,30.48 82.23,29.32 | C51.2 81.47,28.51 81.28,28.7
  Top 1.016: D5.C 80.52,28.28 81.28,29.04
N$76
  Top 0.61: 87.7,57.44 D4.C 86.66,56.43 U$25.7 | L5.1 89.15,54.29 88.77,54.1
  Top 0.813: D4.C 88.65,57.46 88.65,54.1 88.77,54.1 90.08,54.1
  Top 1.016: C34.1 88.73,52.29 88.77,54.1
N$77
  Top 0.406: U$25.6 85.75,55.16 C34.2
N$78
  Bottom 1.676: R63.2 JP4.2
N$79
  Bottom 1.676: R64.2 JP5.2
N$80
  Top 1.016: R89.2 84.9,26.1 SJ2.1 85.09,29.46 86.11,30.48 86.11,30.95 L2.1 | L2.1 86.04,31.01 | 83.57,35.63 C56.1 | 83.57,35.63 83.57,40.13 C44.+ | 83.57,35.63 83.57,33.49 L2.1
N$81
  Bottom 1.676: R65.2 JP6.2
N$82
  Top 0.61: C53.1 IC3.8
  Top 1.016: L3.1 92.5,42.16 85.09,42.16 | 85.09,42.16 80.77,42.16 72.77,34.16 72.77,27.69 | R91.2 85.16,42.1 85.09,42.16 | 72.77,27.69 72.77,21.08 72.14,20.57 C21.+ | C53.1 72.71,27.75 72.77,27.69
N$83
  Bottom 1.676: R66.2 JP7.2
N$84  (via drill 0.6)
  Top 0.61: v75.69,30.99 75.69,27.05 75.56,26.8 IC3.7
  Top 1.016: R91.1 87.88,35.81 88.39,35.31 88.39,33.75 89.16,32.99 90.65,32.99 JP11.2
  Bottom 0.61: v75.69,30.99 77.72,33.02 JP11.2 | JP11.2 90.61,33.09 | C55.1 90.74,33.09 JP11.2
N$85  (via drill 1.3)
  Top 1.016: v98.04,37.59 98.04,40.35 L3.2
  Bottom 1.016: D6.C 96.27,37.53 C54.1 v98.04,37.59
N$86
  Bottom 1.676: R61.2 JP1.2
N$87
  Bottom 1.016: JP11.3 96.18,30.48 D6.A
N$88
  Bottom 1.27: JP8.2
  Bottom 1.676: R60.2 JP8.2
P2.7  (via drill 0.6)
  Top 0.254: U$1.54 32.19,40.82 33.53,42.16 v33.53,42.67
  Bottom 0.254: IC1.1 13.15,39.11 R87.1 15.43,39.05 16.76,40.39 16.76,40.77 17.02,41.02 22.73,41.02 24.64,42.93 28.45,42.93 28.96,43.43 32.77,43.43 v33.53,42.67
P10.0  (via drill 0.5, 0.6)
  Top 0.254: U$1.59 29.69,43.15 30.48,43.94 30.48,45.21 29.21,46.48 13.46,46.48 v12.7,45.72 | v12.7,45.72 12.39,45.72 12.31,45.63 | 12.31,45.63 11.43,44.7 9.4,44.7 9.13,44.97 LED1.C 6.81,44.41 v6.1,43.69 | v12.7,45.72 12.39,45.72 12.31,45.63
  Bottom 0.254: R78.2 v6.1,43.69 0.76,38.35 0.76,14.99 2.71,13.04 X8_P10L_CC6X.9 | IC1.5 16.26,44.2 14.73,45.72 v12.7,45.72
P10.1  (via drill 0.5)
  Top 0.254: U$1.60 29.19,43.41 29.97,44.2 29.97,44.96 28.96,45.97 14.73,45.97 11.18,42.42 6.83,42.42 | 6.83,42.42 LED2.C | 6.83,42.42 6.83,41.88 v6.1,41.15
  Bottom 0.254: X8_P10L_CC6X.8 5.34,15.49 4.57,15.49 3.56,14.48 2.29,14.48 1.27,15.49 1.27,36.32 v6.1,41.15 R79.2
P10.2  (via drill 0.5)
  Top 0.254: U$1.62 28.19,43.93 28.19,44.7 27.43,45.47 14.99,45.47 9.4,39.88 6.83,39.88 | 6.83,39.88 LED3.C | 6.83,39.88 6.83,39.34 v6.1,38.61
  Bottom 0.254: R80.2 v6.1,38.61 1.78,34.29 1.78,16.26 2.46,15.58 X8_P10L_CC6X.7
P10.3  (via drill 0.5)
  Top 0.254: U$1.67 25.69,39.08 24.38,40.39 24.38,42.16 22.35,44.2 14.48,44.2 7.62,37.34 6.86,37.34 | 6.86,37.34 6.83,37.34 LED4.C | 6.86,37.34 6.86,36.83 v6.1,36.07
  Bottom 0.254: R81.2 v6.1,36.07 6.1,34.8 8.13,32.77 8.13,20.82 X8_P10L_CC6X.6
P10.4  (via drill 0.5)
  Top 0.254: U$1.69 24.69,39.32 23.88,40.13 23.88,41.91 22.1,43.69 14.73,43.69 9.14,38.1 9.14,36.58 7.37,34.8 6.83,34.8 | 6.83,34.8 LED5.C | 6.83,34.8 6.83,34.26 v6.1,33.53
  Bottom 0.254: v6.1,33.53 6.1,32.26 7.62,30.73 7.62,21.08 5.84,19.3 4.07,19.3 X8_P10L_CC6X.5
P10.5  (via drill 0.5, 0.6)
  Top 0.254: U$1.70 24.19,39.06 23.37,39.88 23.37,41.4 21.84,42.93 v20.83,42.93 20.57,43.18 14.99,43.18 9.65,37.85 9.65,36.32 7.62,34.29 7.62,32.51 7.37,32.26 6.83,32.26 | 6.83,32.26 LED6.C | 6.83,32.26 6.83,31.72 v6.1,30.99
  Bottom 0.254: X8_P10L_CC6X.4 5.68,20.92 7.11,22.35 7.11,28.7 6.1,29.72 v6.1,30.99 | v20.83,42.93 IC1.6
P10.6  (via drill 0.5)
  Top 0.254: U$1.72 23.19,39.3 22.86,39.62 22.86,40.89 21.59,42.16 20.32,42.16 19.94,42.55 15.11,42.55 10.16,37.59 10.16,36.07 8.13,34.04 8.13,30.48 7.37,29.72 6.83,29.72 | 6.83,29.72 LED7.C | 6.83,29.72 6.83,29.18 v6.1,28.45
  Bottom 0.254: X8_P10L_CC6X.3 4.06,21.84 4.06,26.42 v6.1,28.45
P10.7  (via drill 0.5, 0.6)
  Top 0.254: U$1.73 22.69,39.04 22.35,39.37 22.35,40.64 21.34,41.66 v15.49,41.66 10.67,36.83 10.67,35.81 8.64,33.78 8.64,28.45 7.37,27.18 6.83,27.18 LED8.C
  Top 0.305: LED8.C 6.81,26.63 v6.1,25.91
  Bottom 0.254: v15.49,41.66 IC1.2
  Bottom 0.305: v6.1,25.91 5.42,25.24 X8_P10L_CC6X.2
P10.11  (via drill 0.5)
  Top 0.254: v42.16,15.75 R2.2 | U$1.83 19.34,33.23 17.02,35.56 11.18,35.56 9.14,33.53 9.14,15.49 12.95,11.68 v13.72,11.68
  Bottom 0.254: v42.16,15.75 42.16,13.72 41.66,13.21 24.13,13.21 22.35,14.99 21.34,14.99 18.03,11.68 v13.72,11.68
RXDC0
  Top 0.254: U$1.39 36.57,31.23 38.1,32.77 39.88,32.77 40.89,31.75 40.89,29.21 42.16,27.94 42.16,21.08 41.4,20.32 41.4,15.49 42.42,14.48 U$3.4
RXDC1  (via drill 0.6)
  Top 0.254: U$1.45 37.28,34.23 37.34,34.29 42.67,34.29 42.93,34.54 46.48,34.54 48.01,33.02 48.01,24.13 v51.05,21.08 | v61.47,17.78 63.25,17.78 64.14,16.89 U$4.4
  Bottom 0.254: v51.05,21.08 54.36,17.78 v61.47,17.78
S1
  Top 0.254: U$5.28 58.82,54.02 60.52,52.32 70.87,52.32 75.18,56.64 R51.1
S2
  Top 0.254: U$5.26 59.82,54.41 60.64,53.59 64.77,53.59 66.04,54.86 R50.1
S3
  Top 0.254: U$5.24 60.82,56.08 58.93,57.98 R49.1
S4  (via drill 0.6)
  Top 0.254: v53.85,56.9 53.34,57.4 47.82,57.4 R48.1 | U$5.22 61.57,50.5 58.17,53.91 v57.59,53.91
  Bottom 0.254: v53.85,56.9 56.01,54.67 56.83,54.67 v57.59,53.91
S5
  Top 0.254: U$5.20 60.57,50.11 58.1,52.58 41.4,52.58 38.61,55.37 R47.1
S6
  Top 0.254: U$5.18 59.57,49.71 57.72,51.56 31.75,51.56 29.46,53.85 R46.1
S7
  Top 0.254: U$5.16 58.57,49.31 57.34,50.55 24.38,50.55 20.32,54.61 R45.1
S8
  Top 0.254: R44.1 10.92,55.63 17.53,49.02 40.64,49.02 42.04,47.62 48.64,47.62 50.42,45.85 51.82,45.85 52.07,45.59 55.63,45.59 55.88,45.85 57.02,45.85 57.57,46.4 U$5.14
SCK  (via drill 0.6)
  Top 0.254: v52.32,53.91 U$5.41 | v52.32,44.7 52.32,43.94 53.59,42.67 R27.1
  Bottom 0.254: v52.32,44.7 v52.32,53.91 | v52.32,44.7 52.32,44.52 | U$6.1 52.9,43.62 52.32,44.2 v52.32,44.7
SCKG  (via drill 0.6)
  Top 0.254: SV5.1 R27.2
  Top 0.406: SV5.1 63.5,42.67 65.02,44.2 v71.37,44.2 72.14,43.43 72.14,38.86 71.37,38.1 71.37,30.48 67.44,26.54 U$24.10
  Bottom 0.406: R34.2 73.87,44.2 v71.37,44.2 v71.37,44.19 R73.1
SDI  (via drill 0.6)
  Top 0.254: U$5.42 51.82,54.62 v51.12,53.91 | R30.2 53.59,41.4 51.05,43.94 v51.05,44.96
  Bottom 0.254: v51.12,53.91 51.05,53.85 v51.05,44.96 51.05,44.45 51.82,43.69 51.82,42.16 51.37,41.72 U$6.4
SDIG  (via drill 0.6)
  Top 0.406: U$24.12 67.44,29.08 70.61,32.26 70.61,38.35 70.87,38.61 v70.87,42.16 70.36,42.67 SV5.2 64.77,42.67 63.5,41.4 R30.1
  Bottom 0.406: R72.1 69.9,42.16 v70.87,42.16 73.69,42.16 R35.2
SDO  (via drill 0.6)
  Top 0.254: U$5.43 51.32,56.37 51.05,56.64 49.78,56.64 48.58,55.44 v48.58,53.91 | R28.2 53.47,38.73 48.26,43.94 v48.26,45.21
  Bottom 0.254: v48.58,53.91 48.26,53.59 v48.26,45.21 48.26,42.42 50.04,40.64 51.82,40.64 52.9,41.72 U$6.3
SDOG
  Top 0.254: R28.1 64.14,38.73 SV5.4
  Top 0.406: U$24.2 59.31,32.89 58.67,33.53 58.67,35.56 60.71,37.59 60.71,38.67 R28.1
TCLK  (via drill 0.6)
  Top 0.254: U$1.57 30.69,42.62 32.26,44.2 37.59,44.2 v38.1,43.69
  Bottom 0.254: OCDS.11 42.16,24.48 42.16,26.42 42.93,27.18 44.2,27.18 44.7,27.69 44.45,39.37 40.13,43.69 v38.1,43.69
TDI  (via drill 0.6)
  Top 0.254: U$1.23 32.69,20.78 v33.02,20.45
  Bottom 0.254: v33.02,20.45 34.54,22.1 37.08,22.1 37.34,22.35 41.4,26.37 OCDS.7
TDO  (via drill 0.5)
  Top 0.254: U$1.6 24.19,22.28 23.88,21.97 23.88,21.46 v23.62,21.21
  Bottom 0.254: OCDS.3 43.18,33.22 43.18,33.27 41.4,31.5 41.4,27.18 36.83,22.61 24.13,22.61 23.62,22.1 v23.62,21.21
TMS  (via drill 0.6)
  Top 0.254: U$1.28 37.38,25.73 v37.72,25.4
  Bottom 0.254: OCDS.1 43.38,35.25 40.64,32.51 40.64,28.45 38.86,26.67 v37.72,25.4
TREF  (via drill 0.6)
  Top 0.254: U$1.65 26.69,39.61 25.91,40.39 25.91,43.18 v25.15,43.94
  Bottom 0.254: R4.1 26.79,44.26 C17.1 25.15,45.02 v25.15,43.94
TXDC0
  Top 0.254: U$1.40 36.31,31.73 37.85,33.27 40.64,33.27 41.66,32.26 41.66,30.99 42.93,29.72 46.23,29.72 46.99,28.96 46.99,22.86 48.51,21.34 48.51,18.8 51.94,15.37 U$3.1
TXDC1  (via drill 0.6)
  Top 0.254: U$1.41 36.04,32.23 37.59,33.78 41.4,33.78 43.18,32 46.48,32 47.5,30.99 47.5,23.37 49.02,21.84 49.02,20.32 49.02,19.56 v50.8,17.78 | v67.31,17.53 67.94,16.89 U$4.1
  Bottom 0.254: v50.8,17.78 52.58,16 53.85,16 54.61,16.76 59.94,16.76 60.45,16.26 65.28,16.26 66.55,17.53 v67.31,17.53
U0C0RXD  (via drill 0.5)
  Top 0.254: U$1.9 25.69,21.62 v25.65,21.72 | v16,14.73 16,6.35 16.76,5.59 X13_UART.3
  Bottom 0.254: v25.65,21.72 25.65,21.21 24.38,19.94 22.99,19.94 22.61,20.32 19.18,20.19 16,17.02 v16,14.73
U0C0TXD  (via drill 0.5)
  Top 0.254: U$1.7 24.69,21.77 v24.64,21.72 | v14.73,14.73 14.73,6.35 14.22,5.84 X13_UART.2
  Bottom 0.254: v24.64,21.72 24.64,21.08 24,20.45 23.24,20.45 22.86,20.83 18.92,20.7 14.73,16.51 v14.73,14.73
U0C1SCL  (via drill 0.6)
  Top 0.254: U$1.56 31.19,41.85 v31.62,42.29 | 38.86,38.35 SV4.2
  Top 0.305: 38.86,38.35 38.86,38.61 v36.07,41.4
  Bottom 0.254: v31.62,42.29 32.64,42.29 33.53,41.4 | 36.07,41.42 R84.2
  Bottom 0.305: 33.53,41.4 v36.07,41.4
  Bottom 0.61: v36.07,41.4 36.07,41.42
U0C1SDA  (via drill 0.6)
  Top 0.254: U$1.66 26.19,39.35 25.15,40.39 v25.15,40.89 | 41.84,40.89 41.91,40.89 42.42,40.39 42.42,38.29 R32.2
  Top 0.305: SV4.1 41.84,40.89
  Bottom 0.254: 25.34,40.7 v25.15,40.89 25.65,41.4 29.72,41.4 31.5,39.88 37.08,39.88 38.1,40.89 SV4.1
U1C0MISO  (via drill 0.6)
  Top 0.254: U$1.53 32.69,40.56 34.54,42.42 42.16,42.42 44.45,40.13 44.45,40.12 49.53,35.05 49.79,34.8 v49.79,34.02 50.1,33.7 R77.1
  Top 0.406: U$24.16 64.9,34.16 v64.77,34.04
  Bottom 0.254: v49.79,34.02 49.53,34.02
  Bottom 0.406: v64.77,34.04 52.34,34.04 v49.79,34.02 49.53,34.02 R83.1
U1C0MOSI
  Top 0.254: U$1.55 31.69,41.08 32.26,41.66 32.51,41.91 32.51,42.93 33.27,43.69 36.83,43.69 37.59,42.93 42.42,42.93 51.18,34.16 51.18,28.57 51.94,27.81 U$24.6
U1C0SCLK  (via drill 0.6)
  Top 0.254: U$1.58 30.19,42.89 32,44.7 41.4,44.7 52.07,34.04 v52.07,30.23 | U$24.8 52.96,25.27 v52.07,26.16
  Bottom 0.254: v52.07,30.23 v52.07,26.16
V+  (via drill 0.6)
  Top 0.254: U$5.4 52.57,47.06 C38.1
  Top 0.61: U$25.8 84.92,58.51 86.87,60.45 C41.1
  Top 0.813: C38.1 50.8,46.74 49.02,48.51 v42.42,48.51 | C32.+ 88.2,62.49 C41.1 88.2,64.84 89.66,66.29 94.49,66.29 96.01,64.77 SV3.4
  Bottom 0.813: R31.1 23.11,49.28 23.88,48.51 v42.42,48.51 44.7,46.23 44.7,44.7 49.78,39.62 53.09,39.62 64.01,50.55 77.47,50.55 80.52,53.59 83.06,53.59 87.88,58.42 SV3.4
VAGND  (via drill 0.5, 0.6)
  Top 0.254: X1_ANA.15 X1_ANA.16 44.35,7.91 R7.2 44.25,11.12 v41.4,13.97 | U$1.21 31.69,19.37 v32,19.05
  Bottom 0.254: v32,19.05 37.08,13.97 v41.4,13.97
VAREF  (via drill 0.6)
  Top 0.254: R6.2 C20.1 26.26,3.11 X1_ANA.1 | U$1.20 31.19,12.25 31.5,11.94 v31.5,6.86
  Bottom 0.254: v31.5,6.86 30.23,5.59 30.23,4.57 29.72,4.06 27.82,4.06 X1_ANA.1
VMODE  (via drill 0.6)
  Top 0.254: U$5.40 52.82,54.62 v53.53,53.91 | v53.59,44.7 54.48,43.81 63.37,43.81 67.06,47.5
  Top 0.305: 67.06,47.5 67.06,47.75 SV2.2
  Bottom 0.254: v53.53,53.91 53.59,53.85 v53.59,44.7
VREF  (via drill 0.6)
  Top 0.254: U$5.33 56.32,53.91 v56.39,53.91
  Bottom 0.254: v56.39,53.91 56.39,53.09 C39.1
VREG  (via drill 0.6)
  Top 0.254: v55.12,53.91 55.82,54.6 U$5.34 U$5.35 U$5.36 | v55.12,44.7 62.48,44.7 64.52,46.74
  Top 0.305: 64.52,46.74 SV2.3
  Bottom 0.254: 55.12,50.42 v55.12,44.7 53.85,43.18 52.58,43.18 52.32,42.93 52.32,41.91 51.56,41.15 50.29,41.15 50.04,41.4 50.04,42.42 50.29,42.67 U$6.5 | 55.12,50.42 v55.12,53.91 | 55.12,50.42 C37.1
  Bottom 0.406: 64.52,47.92 SV2.3 64.6,47.16 66.04,45.72 75.18,45.72 75.79,45.12 R34.1 | SV3.3 93.47,55.88 92.46,56.9 90.47,56.9 77.75,44.18 R34.1 | R34.1 R35.1 75.78,42.34 75.69,42.42 75.69,41.66 74.64,40.6 R33.1
VTEMP
  Bottom 0.61: D3.C D2.C D1.C 10.33,50.12 9.91,50.55 L1.1
  Bottom 0.813: R31.2 21.02,52 20.32,51.31 D3.C